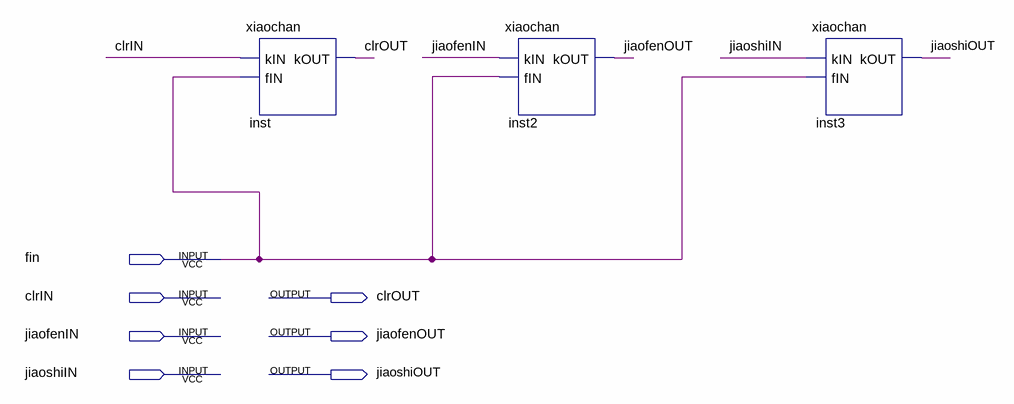
[diagram p0: schematic sheet]
// Quartus schematic naozhongxiaochan.bdf as structural Verilog: 3 symbols, 7 pins
module naozhongxiaochan (
  input  fin,
  input  clrIN,
  input  jiaofenIN,
  input  jiaoshiIN,
  output clrOUT,
  output jiaofenOUT,
  output jiaoshiOUT
);

  xiaochan inst (.kIN(clrIN), .fIN(fin), .kOUT(clrOUT));
  xiaochan inst2 (.kIN(jiaofenIN), .fIN(fin), .kOUT(jiaofenOUT));
  xiaochan inst3 (.kIN(jiaoshiIN), .fIN(fin), .kOUT(jiaoshiOUT));
endmodule
